# EAGLE board MotionDetectorCamera (EAGLE 9.6.2), part 1 of 2
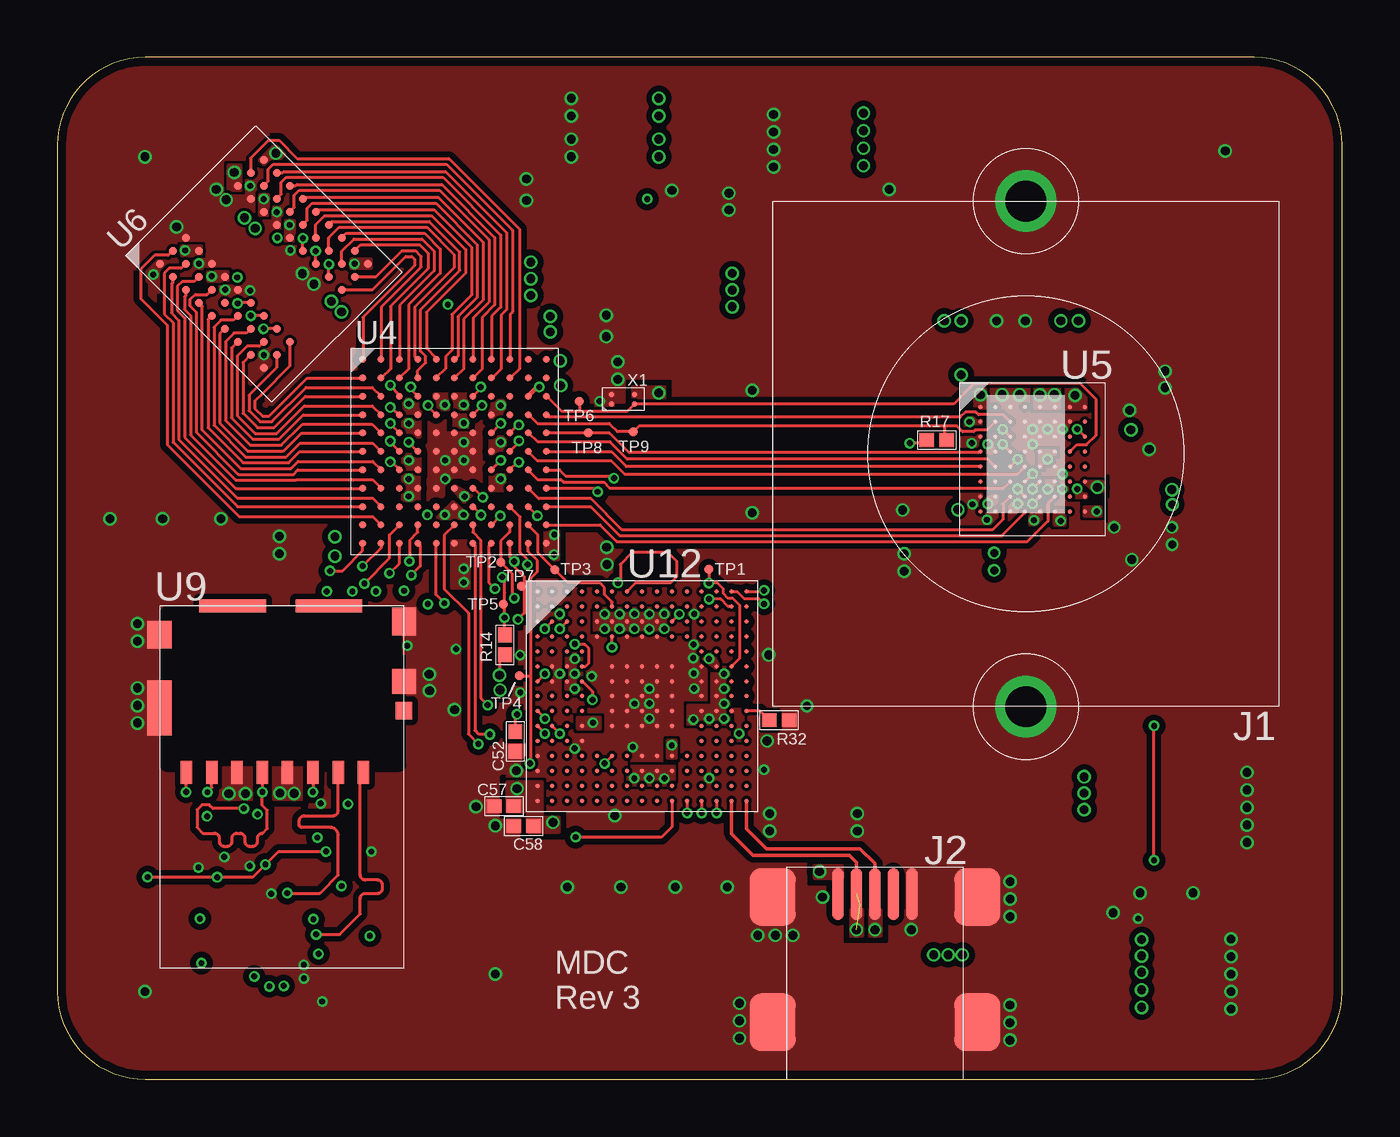
[diagram p7: board, top side]
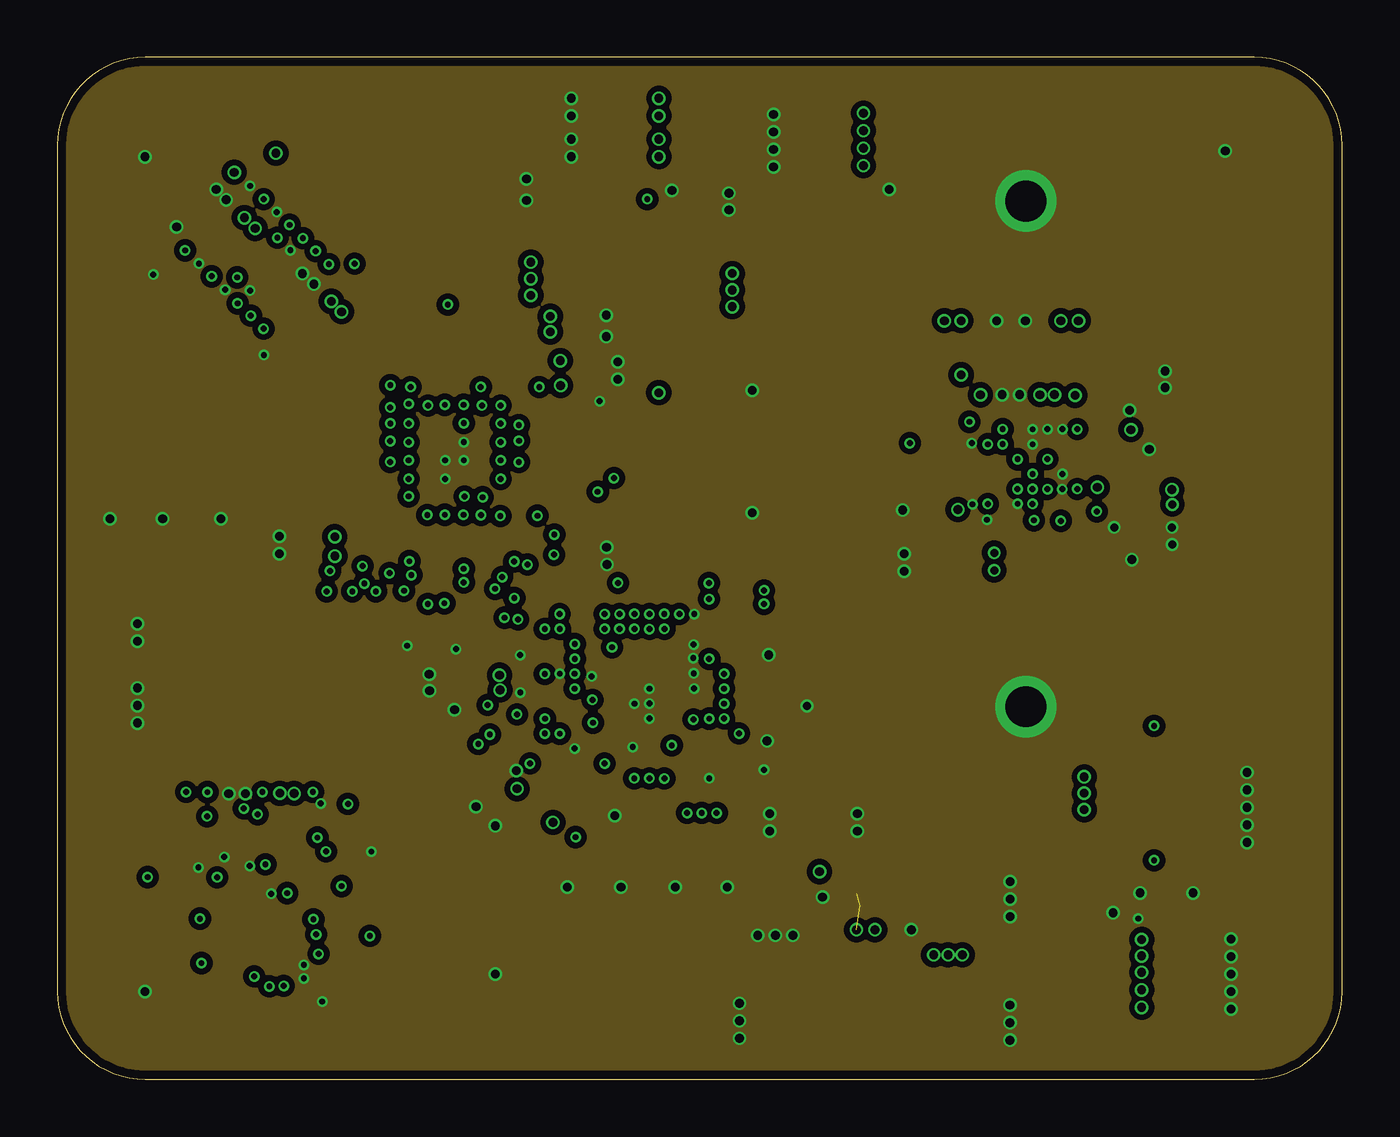
[diagram p8: board, inner layer Ground]
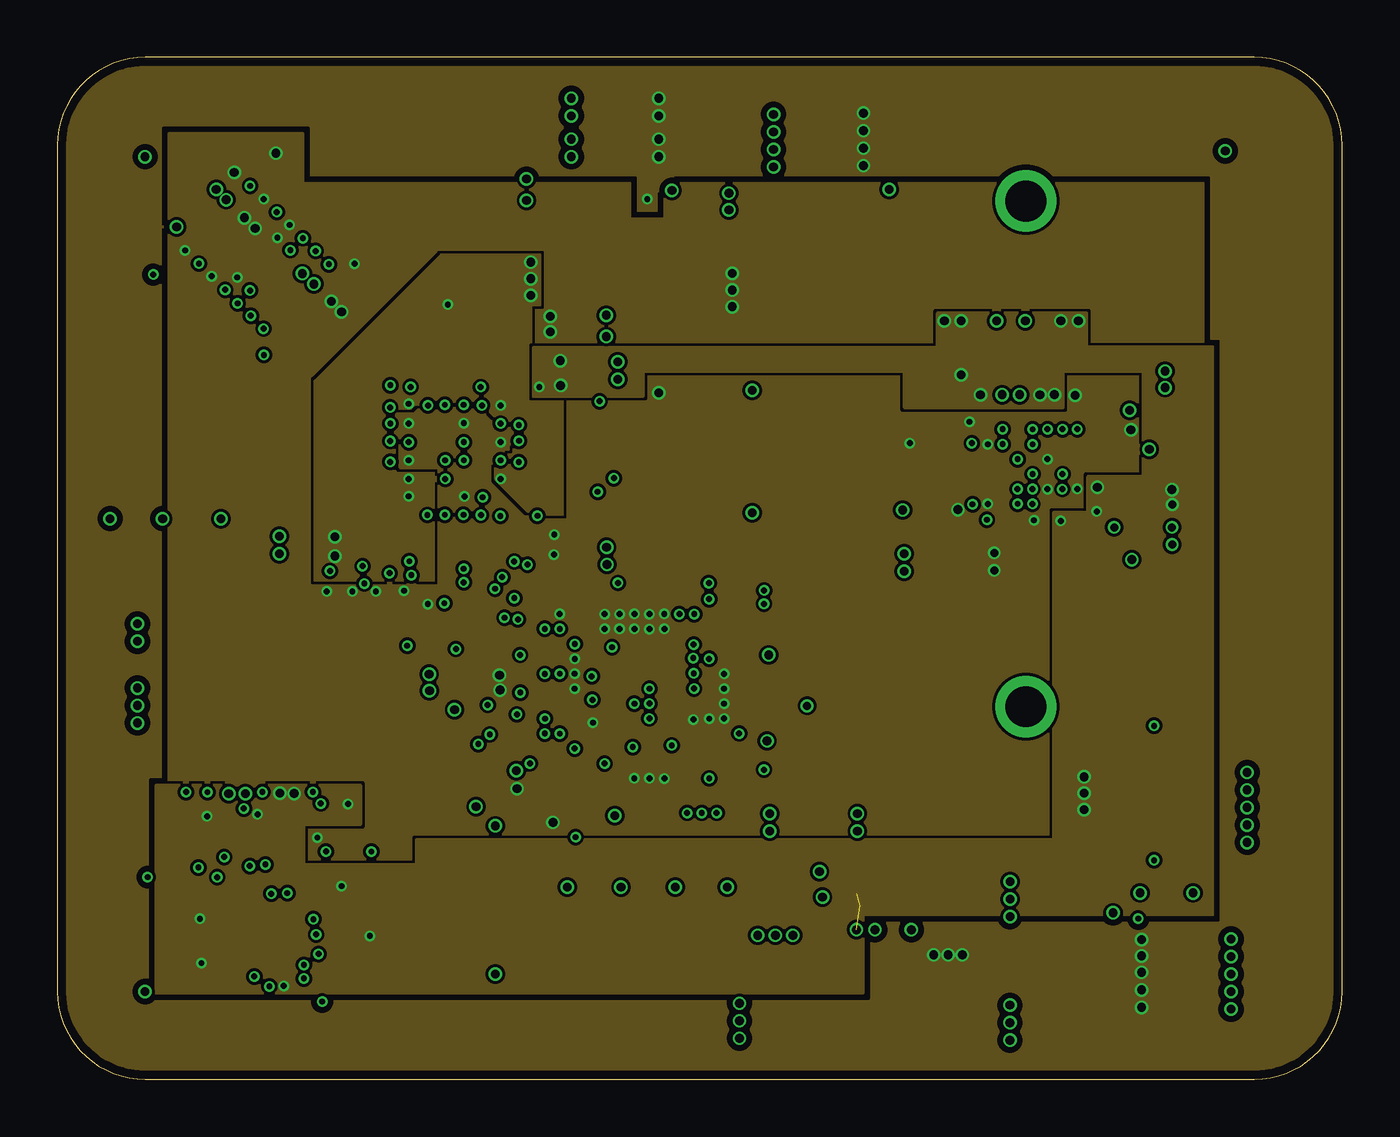
[diagram p9: board, inner layer Power]
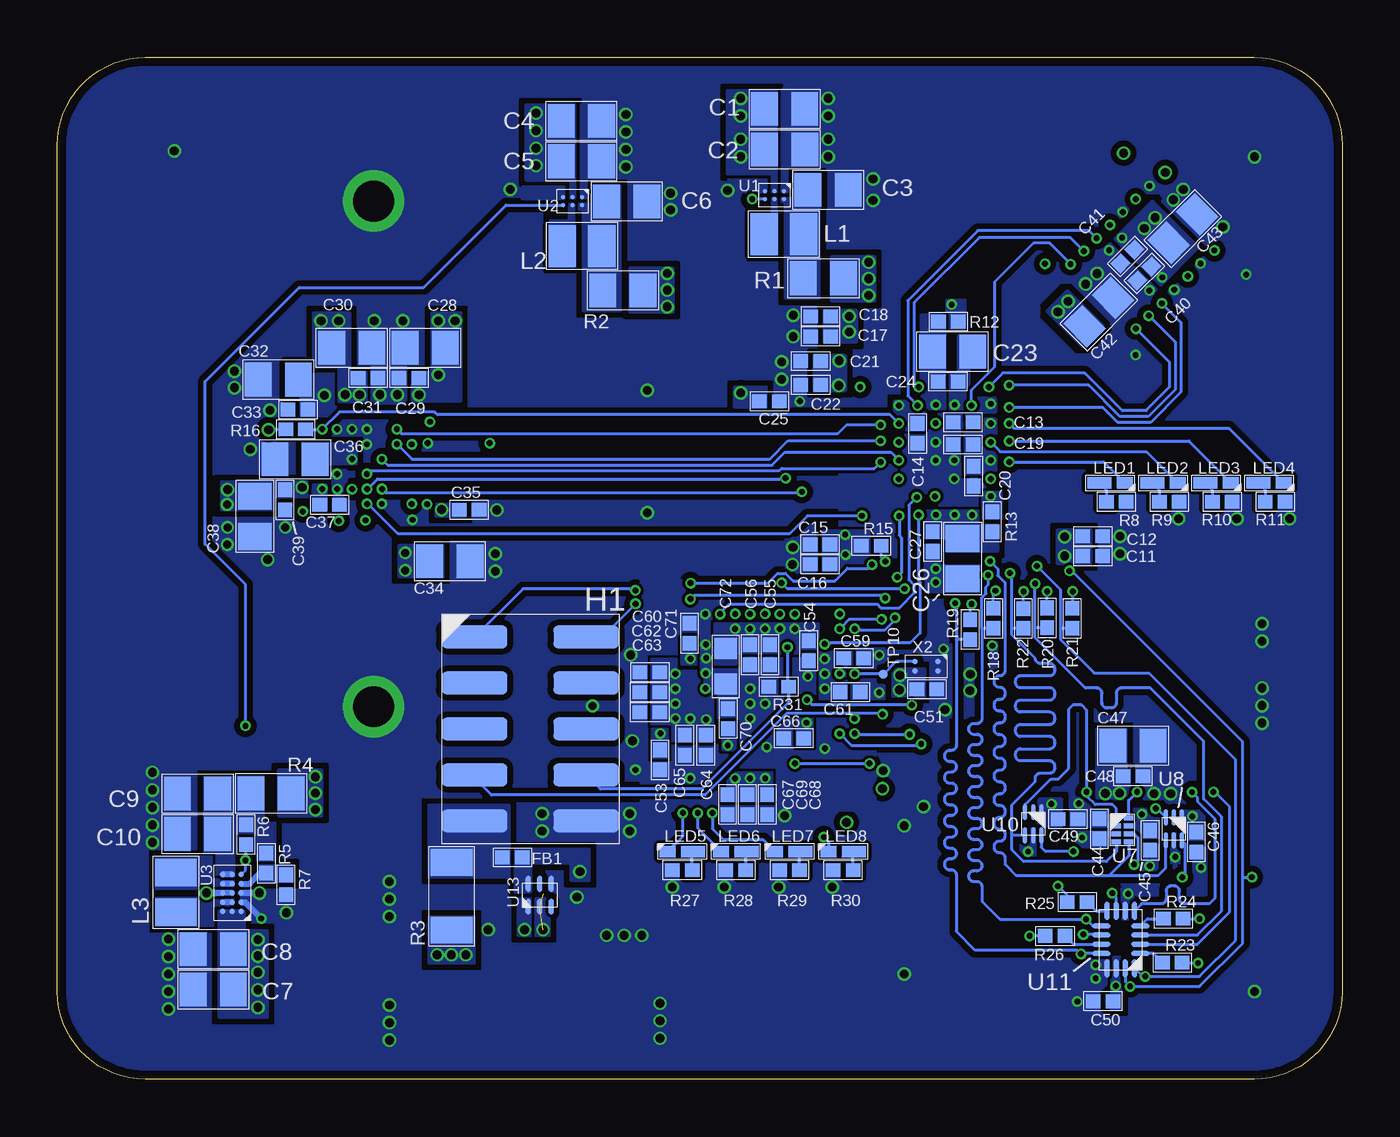
[diagram p10: board, bottom side, seen from below]

Size 55.88 x 44.45 mm. Coordinates in mm from the lower left corner, seen from the top.
Outline: 55.88,3.81 55.88,40.64 arc90 52.07,44.45 3.81,44.45 arc90 0,40.64 0,3.81 arc90 3.81,0 52.07,0 arc90 55.88,3.81
Copper layers (1*2*15*16): Top 0.035559375mm / dielectric 0.17018125mm / Ground 0.01778125mm / dielectric 47mil / Power 0.01778125mm / dielectric 0.17018125mm / Bottom 0.035559375mm
Design rules "oshpark-4layer *": minimum track width 5mil, minimum drill 10mil, track to track 5mil, track to pad 5mil, pad to pad 5mil, via to via 5mil, smd to smd 5mil, copper to edge 15mil, drill to drill 6mil, minimum pad ring 4mil, minimum via ring 4mil, stop-mask expansion 2.5mil, vias tented up to drill 25mil, thermal gap 10mil

## Footprints (pad centres in the part's own frame; a part is rotated, then mirrored left to right if it is on the bottom)
0805 = smd 1.165 x 1.465: 1 -0.875,0; 2 0.875,0
0402 = smd 0.635 x 0.6: 1 -0.432,0; 2 0.432,0
0603 = smd 0.921 x 0.97: 1 -0.775,0; 2 0.775,0
TEC-1-2314844-0 = smd 2.85 x 1: 1 -2.425,4; 2 2.425,4; 3 -2.425,2; 4 2.425,2; 5 -2.425,0; 6 2.425,0; 7 -2.425,-2; 8 2.425,-2; 9 -2.425,-4; 10 2.425,-4
S-MOUNT-LENS-HOLDER = drill 1.778: 1 -10.998,0; 2 10.998,0
AMPHENOLFCI-10033526-N3222MLF = smd 0.5 x 2.25: D+ 0,2.85; D- -0.8,2.85; GND 1.6,2.85; ID 0.8,2.85; VCC -1.6,2.85 | smd 2 x 2.5: GND2 -4.45,2.725; GND3 -4.45,-2.725; GND4 4.45,-2.725; GND5 4.45,2.725
0806 = smd 1.196 x 1.815: 1 -0.86,0; 2 0.86,0
LED-0603 = smd 0.7 x 0.5: A -0.641,0 | smd 1.05 x 0.5: C 0.475,0
1206 = smd 1.165 x 1.815: 1 -1.475,0; 2 1.475,0
TEST-POINT = smd 0.4 x 0.4: X 0,0
TI-TPS6280XYKAR = smd 0.2 x 0.2: A1 -0.175,0.406; A2 0.175,0.406; B1 -0.175,0; B2 0.175,0; C1 -0.175,-0.406; C2 0.175,-0.406
TI-TPS63805YFFR = smd 0.23 x 0.23: A1 -0.4,0.8; A2 0,0.8; A3 0.4,0.8; B1 -0.4,0.4; B2 0,0.4; B3 0.4,0.4; C1 -0.4,0; C2 0,0; C3 0.4,0; D1 -0.4,-0.4; D2 0,-0.4; D3 0.4,-0.4; E1 -0.4,-0.8; E2 0,-0.8; E3 0.4,-0.8
LATTICE-ICE40HX4K-BG121 = smd 0.3 x 0.3: A1 -4,4; A2 -3.2,4; A3 -2.4,4; A4 -1.6,4; A5 -0.8,4; A6 0,4; A7 0.8,4; A8 1.6,4; A9 2.4,4; A10 3.2,4; A11 4,4; B1 -4,3.2; B2 -3.2,3.2; B3 -2.4,3.2; B4 -1.6,3.2; B5 -0.8,3.2; B6 0,3.2; B7 0.8,3.2; B8 1.6,3.2; B9 2.4,3.2; B10 3.2,3.2; B11 4,3.2; C1 -4,2.4; C2 -3.2,2.4; C3 -2.4,2.4; C4 -1.6,2.4; C5 -0.8,2.4; C6 0,2.4; C7 0.8,2.4; C8 1.6,2.4; C9 2.4,2.4; C10 3.2,2.4; C11 4,2.4; D1 -4,1.6; D2 -3.2,1.6; D3 -2.4,1.6; D4 -1.6,1.6; D5 -0.8,1.6; D6 0,1.6; D7 0.8,1.6; D8 1.6,1.6; D9 2.4,1.6; D10 3.2,1.6; D11 4,1.6; E1 -4,0.8; E2 -3.2,0.8; E3 -2.4,0.8; E4 -1.6,0.8; E5 -0.8,0.8; E6 0,0.8; E7 0.8,0.8; E8 1.6,0.8; E9 2.4,0.8; E10 3.2,0.8; E11 4,0.8; F1 -4,0; F2 -3.2,0; F3 -2.4,0; F4 -1.6,0; F5 -0.8,0; F6 0,0; F7 0.8,0; F8 1.6,0; F9 2.4,0; F10 3.2,0; F11 4,0; G1 -4,-0.8; G2 -3.2,-0.8; G3 -2.4,-0.8; G4 -1.6,-0.8; G5 -0.8,-0.8; G6 0,-0.8; G7 0.8,-0.8; G8 1.6,-0.8; G9 2.4,-0.8; G10 3.2,-0.8; G11 4,-0.8; H1 -4,-1.6; H2 -3.2,-1.6; H3 -2.4,-1.6; H4 -1.6,-1.6; H5 -0.8,-1.6; H6 0,-1.6; H7 0.8,-1.6; H8 1.6,-1.6; H9 2.4,-1.6; H10 3.2,-1.6; H11 4,-1.6; J1 -4,-2.4; J2 -3.2,-2.4; J3 -2.4,-2.4; J4 -1.6,-2.4; J5 -0.8,-2.4; J6 0,-2.4; J7 0.8,-2.4; J8 1.6,-2.4; J9 2.4,-2.4; J10 3.2,-2.4; J11 4,-2.4; K1 -4,-3.2; K2 -3.2,-3.2; K3 -2.4,-3.2; K4 -1.6,-3.2; K5 -0.8,-3.2; K6 0,-3.2; K7 0.8,-3.2; K8 1.6,-3.2; K9 2.4,-3.2; K10 3.2,-3.2; K11 4,-3.2; L1 -4,-4; L2 -3.2,-4; L3 -2.4,-4; L4 -1.6,-4; L5 -0.8,-4; L6 0,-4; L7 0.8,-4; L8 1.6,-4; L9 2.4,-4; L10 3.2,-4; L11 4,-4
ON-AR0330CS1C12SPKA0 = smd 0.2 x 0.2: A1 -2.275,2.275; A2 -1.625,2.275; A3 -0.975,2.275; A4 -0.325,2.275; A5 0.325,2.275; A6 0.975,2.275; A7 1.625,2.275; A8 2.275,2.275; B1 -2.275,1.625; B2 -1.625,1.625; B3 -0.975,1.625; B4 -0.325,1.625; B5 0.325,1.625; B6 0.975,1.625; B7 1.625,1.625; B8 2.275,1.625; C1 -2.275,0.975; C2 -1.625,0.975; C3 -0.975,0.975; C4 -0.325,0.975; C5 0.325,0.975; C6 0.975,0.975; C7 1.625,0.975; C8 2.275,0.975; D1 -2.275,0.325; D2 -1.625,0.325; D3 -0.975,0.325; D4 -0.325,0.325; D5 0.325,0.325; D6 0.975,0.325; D7 1.625,0.325; D8 2.275,0.325; E1 -2.275,-0.325; E2 -1.625,-0.325; E3 -0.975,-0.325; E4 -0.325,-0.325; E5 0.325,-0.325; E6 0.975,-0.325; E7 1.625,-0.325; E8 2.275,-0.325; F1 -2.275,-0.975; F2 -1.625,-0.975; F3 -0.975,-0.975; F4 -0.325,-0.975; F5 0.325,-0.975; F6 0.975,-0.975; F7 1.625,-0.975; F8 2.275,-0.975; G1 -2.275,-1.625; G2 -1.625,-1.625; G3 -0.975,-1.625; G4 -0.325,-1.625; G5 0.325,-1.625; G6 0.975,-1.625; G7 1.625,-1.625; G8 2.275,-1.625; H1 -2.275,-2.275; H2 -1.625,-2.275; H3 -0.975,-2.275; H4 -0.325,-2.275; H5 0.325,-2.275; H6 0.975,-2.275; H7 1.625,-2.275; H8 2.275,-2.275
W989D6DBGX6I = smd 0.35 x 0.35: A1 -3.2,3.2; A2 -2.4,3.2; A3 -1.6,3.2; A7 1.6,3.2; A8 2.4,3.2; A9 3.2,3.2; B1 -3.2,2.4; B2 -2.4,2.4; B3 -1.6,2.4; B7 1.6,2.4; B8 2.4,2.4; B9 3.2,2.4; C1 -3.2,1.6; C2 -2.4,1.6; C3 -1.6,1.6; C7 1.6,1.6; C8 2.4,1.6; C9 3.2,1.6; D1 -3.2,0.8; D2 -2.4,0.8; D3 -1.6,0.8; D7 1.6,0.8; D8 2.4,0.8; D9 3.2,0.8; E1 -3.2,0; E2 -2.4,0; E3 -1.6,0; E7 1.6,0; E8 2.4,0; E9 3.2,0; F1 -3.2,-0.8; F2 -2.4,-0.8; F3 -1.6,-0.8; F7 1.6,-0.8; F8 2.4,-0.8; F9 3.2,-0.8; G1 -3.2,-1.6; G2 -2.4,-1.6; G3 -1.6,-1.6; G7 1.6,-1.6; G8 2.4,-1.6; G9 3.2,-1.6; H1 -3.2,-2.4; H2 -2.4,-2.4; H3 -1.6,-2.4; H7 1.6,-2.4; H8 2.4,-2.4; H9 3.2,-2.4; J1 -3.2,-3.2; J2 -2.4,-3.2; J3 -1.6,-3.2; J7 1.6,-3.2; J8 2.4,-3.2; J9 3.2,-3.2
NXP-NTB0102GF = smd 0.413 x 0.22: 1 -0.275,0.525; 2 -0.275,0.175; 3 -0.275,-0.175; 4 -0.275,-0.525; 5 0.275,-0.525; 6 0.275,-0.175; 7 0.275,0.175; 8 0.275,0.525
ON-NLAS3157MX3TCG = smd 0.711 x 0.19: 1 -0.501,0.35; 2 -0.501,0; 3 -0.501,-0.35; 4 0.501,-0.35; 5 0.501,0; 6 0.501,0.35
MOLEX-1051620001 = smd 0.5 x 1: CLK 5,0.5; CMD 7.2,0.5; DAT0 2.8,0.5; DAT1 1.7,0.5; DAT2 9.4,0.5; DAT3 8.3,0.5; VDD 6.1,0.5; VSS 3.9,0.5 | smd 0.72 x 0.78: DET 11.16,3.18 | smd 1.05 x 1.08: GND1 11.175,4.45 | smd 1.05 x 1.2: GND2 11.175,7.06; GND3 0.525,6.49 | smd 1.05 x 2.39: GND4 0.525,3.305 | smd 2.91 x 0.55: NC1 3.705,7.735; NC2 7.895,7.735
TI-TMUX1574RSVR = smd 0.81 x 0.22: 1 -0.845,0.6; 2 -0.845,0.2; 3 -0.845,-0.2; 4 -0.845,-0.6; 9 0.845,-0.6; 10 0.845,-0.2; 11 0.845,0.2; 12 0.845,0.6 | smd 0.22 x 0.81: 5 -0.6,-1.245; 6 -0.2,-1.245; 7 0.2,-1.245; 8 0.6,-1.245; 13 0.6,1.245; 14 0.2,1.245; 15 -0.2,1.245; 16 -0.6,1.245
STM-STM32F730I8 = smd 0.2 x 0.2: A1 -4.55,4.55; A2 -3.9,4.55; A3 -3.25,4.55; A4 -2.6,4.55; A5 -1.95,4.55; A6 -1.3,4.55; A7 -0.65,4.55; A8 0,4.55; A9 0.65,4.55; A10 1.3,4.55; A11 1.95,4.55; A12 2.6,4.55; A13 3.25,4.55; A14 3.9,4.55; A15 4.55,4.55; B1 -4.55,3.9; B2 -3.9,3.9; B3 -3.25,3.9; B4 -2.6,3.9; B5 -1.95,3.9; B6 -1.3,3.9; B7 -0.65,3.9; B8 0,3.9; B9 0.65,3.9; B10 1.3,3.9; B11 1.95,3.9; B12 2.6,3.9; B13 3.25,3.9; B14 3.9,3.9; B15 4.55,3.9; C1 -4.55,3.25; C2 -3.9,3.25; C3 -3.25,3.25; C4 -2.6,3.25; C5 -1.95,3.25; C6 -1.3,3.25; C7 -0.65,3.25; C8 0,3.25; C9 0.65,3.25; C10 1.3,3.25; C11 1.95,3.25; C12 2.6,3.25; C13 3.25,3.25; C14 3.9,3.25; C15 4.55,3.25; D1 -4.55,2.6; D2 -3.9,2.6; D3 -3.25,2.6; D4 -2.6,2.6; D5 -1.95,2.6; D6 -1.3,2.6; D7 -0.65,2.6; D8 0,2.6; D9 0.65,2.6; D10 1.3,2.6; D11 1.95,2.6; D12 2.6,2.6; D13 3.25,2.6; D14 3.9,2.6; D15 4.55,2.6; E1 -4.55,1.95; E2 -3.9,1.95; E3 -3.25,1.95; E4 -2.6,1.95; E12 2.6,1.95; E13 3.25,1.95; E14 3.9,1.95; E15 4.55,1.95; F1 -4.55,1.3; F2 -3.9,1.3; F3 -3.25,1.3; F4 -2.6,1.3; F6 -1.3,1.3; F7 -0.65,1.3; F8 0,1.3; F9 0.65,1.3; F10 1.3,1.3; F12 2.6,1.3; F13 3.25,1.3; F14 3.9,1.3; F15 4.55,1.3; G1 -4.55,0.65; G2 -3.9,0.65; G3 -3.25,0.65; G4 -2.6,0.65; G6 -1.3,0.65; G7 -0.65,0.65; G8 0,0.65; G9 0.65,0.65; G10 1.3,0.65; G12 2.6,0.65; G13 3.25,0.65; G14 3.9,0.65; G15 4.55,0.65; H1 -4.55,0; H2 -3.9,0; H3 -3.25,0; H4 -2.6,0; H6 -1.3,0; H7 -0.65,0; H8 0,0; H9 0.65,0; H10 1.3,0; H12 2.6,0; H13 3.25,0; H14 3.9,0; H15 4.55,0; J1 -4.55,-0.65; J2 -3.9,-0.65; J3 -3.25,-0.65; J4 -2.6,-0.65; J6 -1.3,-0.65; J7 -0.65,-0.65; J8 0,-0.65; J9 0.65,-0.65; J10 1.3,-0.65; J12 2.6,-0.65; J13 3.25,-0.65; J14 3.9,-0.65; J15 4.55,-0.65; K1 -4.55,-1.3; K2 -3.9,-1.3; K3 -3.25,-1.3; K4 -2.6,-1.3; K6 -1.3,-1.3; K7 -0.65,-1.3; K8 0,-1.3; K9 0.65,-1.3; K10 1.3,-1.3; K12 2.6,-1.3; K13 3.25,-1.3; K14 3.9,-1.3; K15 4.55,-1.3; L1 -4.55,-1.95; L2 -3.9,-1.95; L3 -3.25,-1.95; L4 -2.6,-1.95; L12 2.6,-1.95; L13 3.25,-1.95; L14 3.9,-1.95; L15 4.55,-1.95; M1 -4.55,-2.6; M2 -3.9,-2.6; M3 -3.25,-2.6; M4 -2.6,-2.6; M5 -1.95,-2.6; M6 -1.3,-2.6; M7 -0.65,-2.6; M8 0,-2.6; M9 0.65,-2.6; M10 1.3,-2.6; M11 1.95,-2.6; M12 2.6,-2.6; M13 3.25,-2.6; M14 3.9,-2.6; M15 4.55,-2.6; N1 -4.55,-3.25; N2 -3.9,-3.25; N3 -3.25,-3.25; N4 -2.6,-3.25; N5 -1.95,-3.25; N6 -1.3,-3.25; N7 -0.65,-3.25; N8 0,-3.25; N9 0.65,-3.25; N10 1.3,-3.25; N11 1.95,-3.25; N12 2.6,-3.25; N13 3.25,-3.25; N14 3.9,-3.25; N15 4.55,-3.25; P1 -4.55,-3.9; P2 -3.9,-3.9; P3 -3.25,-3.9; P4 -2.6,-3.9; P5 -1.95,-3.9; P6 -1.3,-3.9; P7 -0.65,-3.9; P8 0,-3.9; P9 0.65,-3.9; P10 1.3,-3.9; P11 1.95,-3.9; P12 2.6,-3.9; P13 3.25,-3.9; P14 3.9,-3.9; P15 4.55,-3.9; R1 -4.55,-4.55; R2 -3.9,-4.55; R3 -3.25,-4.55; R4 -2.6,-4.55; R5 -1.95,-4.55; R6 -1.3,-4.55; R7 -0.65,-4.55; R8 0,-4.55; R9 0.65,-4.55; R10 1.3,-4.55; R11 1.95,-4.55; R12 2.6,-4.55; R13 3.25,-4.55; R14 3.9,-4.55; R15 4.55,-4.55
TI-TPD4S012DRYR = smd 0.71 x 0.22: 1 -0.495,0.5; 2 -0.495,0; 3 -0.495,-0.5; 4 0.495,-0.5; 5 0.495,0; 6 0.495,0.5
SITIME-SIT8021 = smd 0.25 x 0.25: 1 -0.205,0.5; 2 -0.205,-0.5; 3 0.205,-0.5; 4 0.205,0.5

## Placement (x,y rotation side)
C1  10u  [0805]  24.25,42.21 0 bottom
C2  10u  [0805]  24.24,40.45 0 bottom
C3  10u  [0805]  22.36,38.69 0 bottom
C4  10u  [0805]  33.09,41.69 0 bottom
C5  10u  [0805]  33.09,39.93 0 bottom
C6  10u  [0805]  31.12,38.18 0 bottom
C7  10u  [0805]  49.1,3.9 180 bottom
C8  10u  [0805]  49.1,5.66 180 bottom
C9  10u  [0805]  49.78,12.43 180 bottom
C10  10u  [0805]  49.78,10.67 180 bottom
C11  100n  [0402]  10.85,22.76 0 bottom
C12  10n  [0402]  10.85,23.62 0 bottom
C13  100n  [0402]  16.48,28.57 180 bottom
C14  10n  [0402]  18.47,28.09 270 bottom
C15  100n  [0402]  22.71,23.27 180 bottom
C16  10n  [0402]  22.71,22.4 180 bottom
C17  100n  [0402]  22.68,32.31 180 bottom
C18  10n  [0402]  22.68,33.19 180 bottom
C19  100n  [0402]  16.48,27.61 180 bottom
C20  10n  [0402]  16.03,26.24 270 bottom
C21  100n  [0402]  23.11,31.24 180 bottom
C22  10n  [0402]  23.11,30.2 180 bottom
C23  10u  [0805]  16.94,31.66 0 bottom
C24  100n  [0402]  17.14,30.35 0 bottom
C25  10n  [0402]  24.91,29.49 0 bottom
C26  10u  [0805]  16.51,22.65 270 bottom
C27  100n  [0402]  17.81,23.39 270 bottom
C28  10u  [0805]  39.88,31.82 180 bottom
C29  100n  [0402]  40.59,30.51 180 bottom
C30  10u  [0805]  43.08,31.82 0 bottom
C31  100n  [0402]  42.37,30.51 0 bottom
C32  10u  [0805]  46.27,30.43 180 bottom
C33  100n  [0402]  45.42,29.13 180 bottom
C34  10u  [0805]  38.81,22.53 0 bottom
C35  100n  [0402]  37.97,24.77 0 bottom
C36  10u  [0805]  45.54,26.96 180 bottom
C37  100n  [0402]  44.04,24.99 0 bottom
C38  10u  [0805]  47.29,24.49 270 bottom
C39  100n  [0402]  45.98,25.2 270 bottom
C40  100n  [0402]  8.6,35.05 225 bottom
C41  100n  [0402]  9.33,35.79 225 bottom
C42  10u  [0805]  10.58,33.38 45 bottom
C43  10u  [0805]  6.92,37.01 45 bottom
C44  100n  [0402]  10.56,10.9 90 bottom
C45  100n  [0402]  8.35,10.39 270 bottom
C46  100n  [0402]  6.34,10.32 270 bottom
C47  10u  [0805]  9.09,14.5 0 bottom
C48  100n  [0402]  9.09,13.18 0 bottom
C49  100n  [0402]  11.93,11.31 0 bottom
C50  100n  [0402]  10.4,3.39 180 bottom
C51  10n  [0402]  18.06,16.97 0 bottom
C52  100n  [0402]  19.91,14.69 270 top
C53  2.2u  [0402]  29.67,13.89 270 bottom
C54  100n  [0402]  23.2,18.64 270 bottom
C55  100n  [0402]  24.89,18.47 270 bottom
C56  100n  [0402]  25.76,18.47 270 bottom
C57  100n  [0402]  19.43,11.87 180 top
C58  1u  [0402]  20.28,11.02 180 top
C59  100n  [0402]  21.24,18.31 0 bottom
C60  100n  [0402]  30.11,17.71 180 bottom
C61  100n  [0402]  21.39,16.84 0 bottom
C62  100n  [0402]  30.11,16.84 180 bottom
C63  1u  [0402]  30.11,15.97 180 bottom
C64  100n  [0402]  27.67,14.53 270 bottom
C65  100n  [0402]  28.59,14.53 270 bottom
C66  100n  [0402]  23.85,14.83 180 bottom
C67  100n  [0402]  26.73,11.95 270 bottom
C68  100n  [0402]  25,11.95 270 bottom
C69  100n  [0402]  25.87,11.95 270 bottom
C70  2.2u  [0402]  26.71,15.69 90 bottom
C71  2.2u  [0402]  28.38,19.4 90 bottom
C72  4.7u  [0603]  26.81,17.96 270 bottom
FB1  FERRITE-BEAD0402  [0402]  36.09,9.65 180 bottom
H1  HEADER-2X5  [TEC-1-2314844-0]  35.31,15.24 0 bottom
J1  S-MOUNT-LENS-HOLDER  [S-MOUNT-LENS-HOLDER]  42.13,27.2 90 top
J2  MINI-USB-JACK  [AMPHENOLFCI-10033526-N3222MLF]  35.56,5.21 0 top
L1  470n  [0806]  24.28,36.76 0 bottom
L2  470n  [0806]  33.06,36.25 0 bottom
L3  470n  [0806]  50.72,8.13 90 bottom
LED1  LED  [LED-0603]  10.08,25.94 180 bottom
LED2  LED  [LED-0603]  7.78,25.94 180 bottom
LED3  LED  [LED-0603]  5.48,25.94 180 bottom
LED4  LED  [LED-0603]  3.17,25.94 180 bottom
LED5  LED  [LED-0603]  28.7,9.91 0 bottom
LED6  LED  [LED-0603]  26.37,9.91 0 bottom
LED7  LED  [LED-0603]  24.04,9.91 0 bottom
LED8  LED  [LED-0603]  21.7,9.91 0 bottom
R1  0  [0805]  22.56,34.85 180 bottom
R2  0  [0805]  31.28,34.32 180 bottom
R3  1  [1206]  38.73,7.96 90 bottom
R4  0  [0805]  46.59,12.43 180 bottom
R5  422k  [0402]  46.8,9.4 90 bottom
R6  10k  [0402]  47.68,10.64 270 bottom
R7  91k  [0402]  45.94,8.46 90 bottom
R8  1.8k  [0402]  9.82,25.12 0 bottom
R9  1.8k  [0402]  7.52,25.12 0 bottom
R10  1.8k  [0402]  5.21,25.12 0 bottom
R11  1.8k  [0402]  2.91,25.12 0 bottom
R12  100  [0402]  17.12,32.96 0 bottom
R13  100  [0402]  15.21,24.25 90 bottom
R14  10k  [0402]  19.47,18.9 90 top
R15  10k  [0402]  20.48,23.21 0 bottom
R16  10k  [0402]  45.52,28.27 180 bottom
R17  4.7k  [0402]  38.25,27.81 0 top
R18  56k  [0402]  15.16,20.05 90 bottom
R19  56k  [0402]  16.17,19.56 90 bottom
R20  56k  [0402]  12.83,20.07 90 bottom
R21  56k  [0402]  11.73,20.05 90 bottom
R22  56k  [0402]  13.86,20.04 90 bottom
R23  56k  [0402]  7.39,5.08 0 bottom
R24  56k  [0402]  7.34,6.99 0 bottom
R25  56k  [0402]  11.52,7.7 180 bottom
R26  56k  [0402]  12.48,6.23 180 bottom
R27  1.8k  [0402]  28.7,9.09 180 bottom
R28  1.8k  [0402]  26.37,9.09 180 bottom
R29  1.8k  [0402]  24.04,9.09 180 bottom
R30  1.8k  [0402]  21.7,9.09 180 bottom
R31  10k  [0402]  24.51,17.08 0 bottom
R32  3k  [0402]  31.39,15.61 180 top
TP1  TEST-POINT  [TEST-POINT]  28.32,22.18 0 top
TP2  TEST-POINT  [TEST-POINT]  19.29,22.48 0 top
TP3  TEST-POINT  [TEST-POINT]  21.63,22.17 0 top
TP4  TEST-POINT  [TEST-POINT]  20.08,17.55 0 top
TP5  TEST-POINT  [TEST-POINT]  19.39,20.66 0 top
TP6  TEST-POINT  [TEST-POINT]  22.71,29.49 0 top
TP7  TEST-POINT  [TEST-POINT]  20.18,21.45 0 top
TP8  TEST-POINT  [TEST-POINT]  23.09,28.12 0 top
TP9  TEST-POINT  [TEST-POINT]  25.04,28.17 0 top
TP10  TEST-POINT  [TEST-POINT]  19.95,17.63 180 bottom
U1  TI-TPS6280XYKAR  [TI-TPS6280XYKAR]  24.69,38.47 270 bottom
U2  TI-TPS6280XYKAR  [TI-TPS6280XYKAR]  33.47,38.2 270 bottom
U3  TI-TPS63805YFFR  [TI-TPS63805YFFR]  48.29,8.1 180 bottom
U4  LATTICE-ICE40HX4K-BG121  [LATTICE-ICE40HX4K-BG121]  17.27,27.31 0 top
U5  ON-AR0330CS1C12SPKA0  [ON-AR0330CS1C12SPKA0]  42.42,26.97 0 top
U6  W989D6DBGX6I  [W989D6DBGX6I]  8.97,35.47 45 top
U7  NXP-NTB0102  [NXP-NTB0102GF]  9.55,10.85 0 bottom
U8  ON-NLAS3157  [ON-NLAS3157MX3TCG]  7.32,10.88 270 bottom
U9  MICROSD-SOCKET  [MOLEX-1051620001]  3.91,12.85 0 top
U10  ON-NLAS3157  [ON-NLAS3157MX3TCG]  13.44,11.12 270 bottom
U11  TI-TMUX1574  [TI-TMUX1574RSVR]  9.63,6.07 180 bottom
U12  STM-STM32F730  [STM-STM32F730I8]  25.43,16.66 0 top
U13  TI-TPD4S012DRYR  [TI-TPD4S012DRYR]  34.91,8.01 90 bottom
X1  SITIME-SIT8021  [SITIME-SIT8021]  24.61,29.58 90 top
X2  SITIME-SIT8021  [SITIME-SIT8021]  18.08,17.96 270 bottom